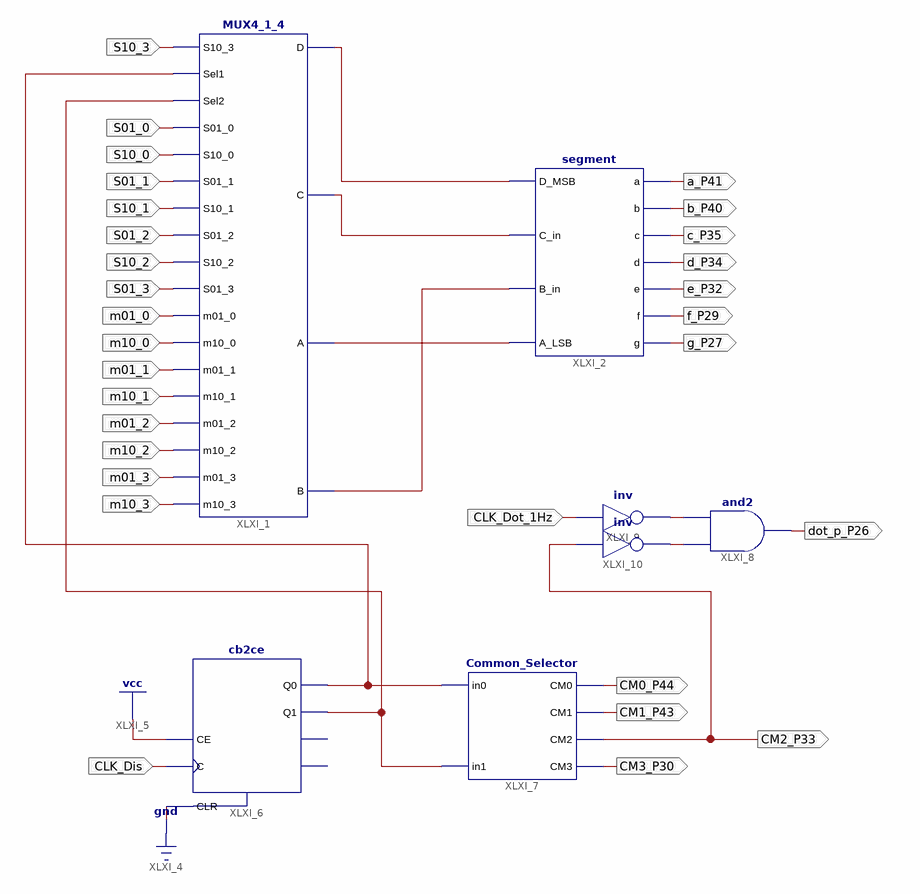
[diagram p0: schematic sheet 1]
// Xilinx ISE schematic Display.sch (spartan6) as structural Verilog: 7 symbols, 30 ports
module Display (
  input  S10_3,
  input  S01_0,
  input  S10_0,
  input  S01_1,
  input  S10_1,
  input  S01_2,
  input  S10_2,
  input  S01_3,
  input  m01_0,
  input  m10_0,
  input  m01_1,
  input  m10_1,
  input  m01_2,
  input  m10_2,
  input  m01_3,
  input  m10_3,
  input  CLK_Dis,
  input  CLK_Dot_1Hz,
  output a_P41,
  output b_P40,
  output c_P35,
  output d_P34,
  output e_P32,
  output f_P29,
  output g_P27,
  output CM0_P44,
  output CM1_P43,
  output CM2_P33,
  output CM3_P30,
  output dot_p_P26
);

  wire Sel1, Sel2, XLXN_1, XLXN_2, XLXN_3, XLXN_4, XLXN_42, XLXN_43;

  MUX4_1_4 XLXI_1 (
    .S10_3(S10_3), .Sel1(Sel1), .Sel2(Sel2), .S01_0(S01_0), .S10_0(S10_0), .S01_1(S01_1), .S10_1(S10_1),
    .S01_2(S01_2), .S10_2(S10_2), .S01_3(S01_3), .m01_0(m01_0), .m10_0(m10_0), .m01_1(m01_1), .m10_1(m10_1),
    .m01_2(m01_2), .m10_2(m10_2), .m01_3(m01_3), .m10_3(m10_3), .D(XLXN_1), .C(XLXN_2), .A(XLXN_3), .B(XLXN_4));
  segment XLXI_2 (
    .D_MSB(XLXN_1), .C_in(XLXN_2), .B_in(XLXN_4), .A_LSB(XLXN_3), .a(a_P41), .b(b_P40), .c(c_P35), .d(d_P34),
    .e(e_P32), .f(f_P29), .g(g_P27));
  cb2ce XLXI_6 (.C(CLK_Dis), .CE(1'b1), .CLR(1'b0), .Q0(Sel1), .Q1(Sel2));  // open: CEO, TC
  Common_Selector XLXI_7 (.in0(Sel1), .in1(Sel2), .CM0(CM0_P44), .CM1(CM1_P43), .CM2(CM2_P33), .CM3(CM3_P30));
  and XLXI_8 (dot_p_P26, XLXN_43, XLXN_42);
  not XLXI_9 (XLXN_42, CLK_Dot_1Hz);
  not XLXI_10 (XLXN_43, CM2_P33);
endmodule
